# EAGLE design ColorDisplay (EAGLE 7.1.0)
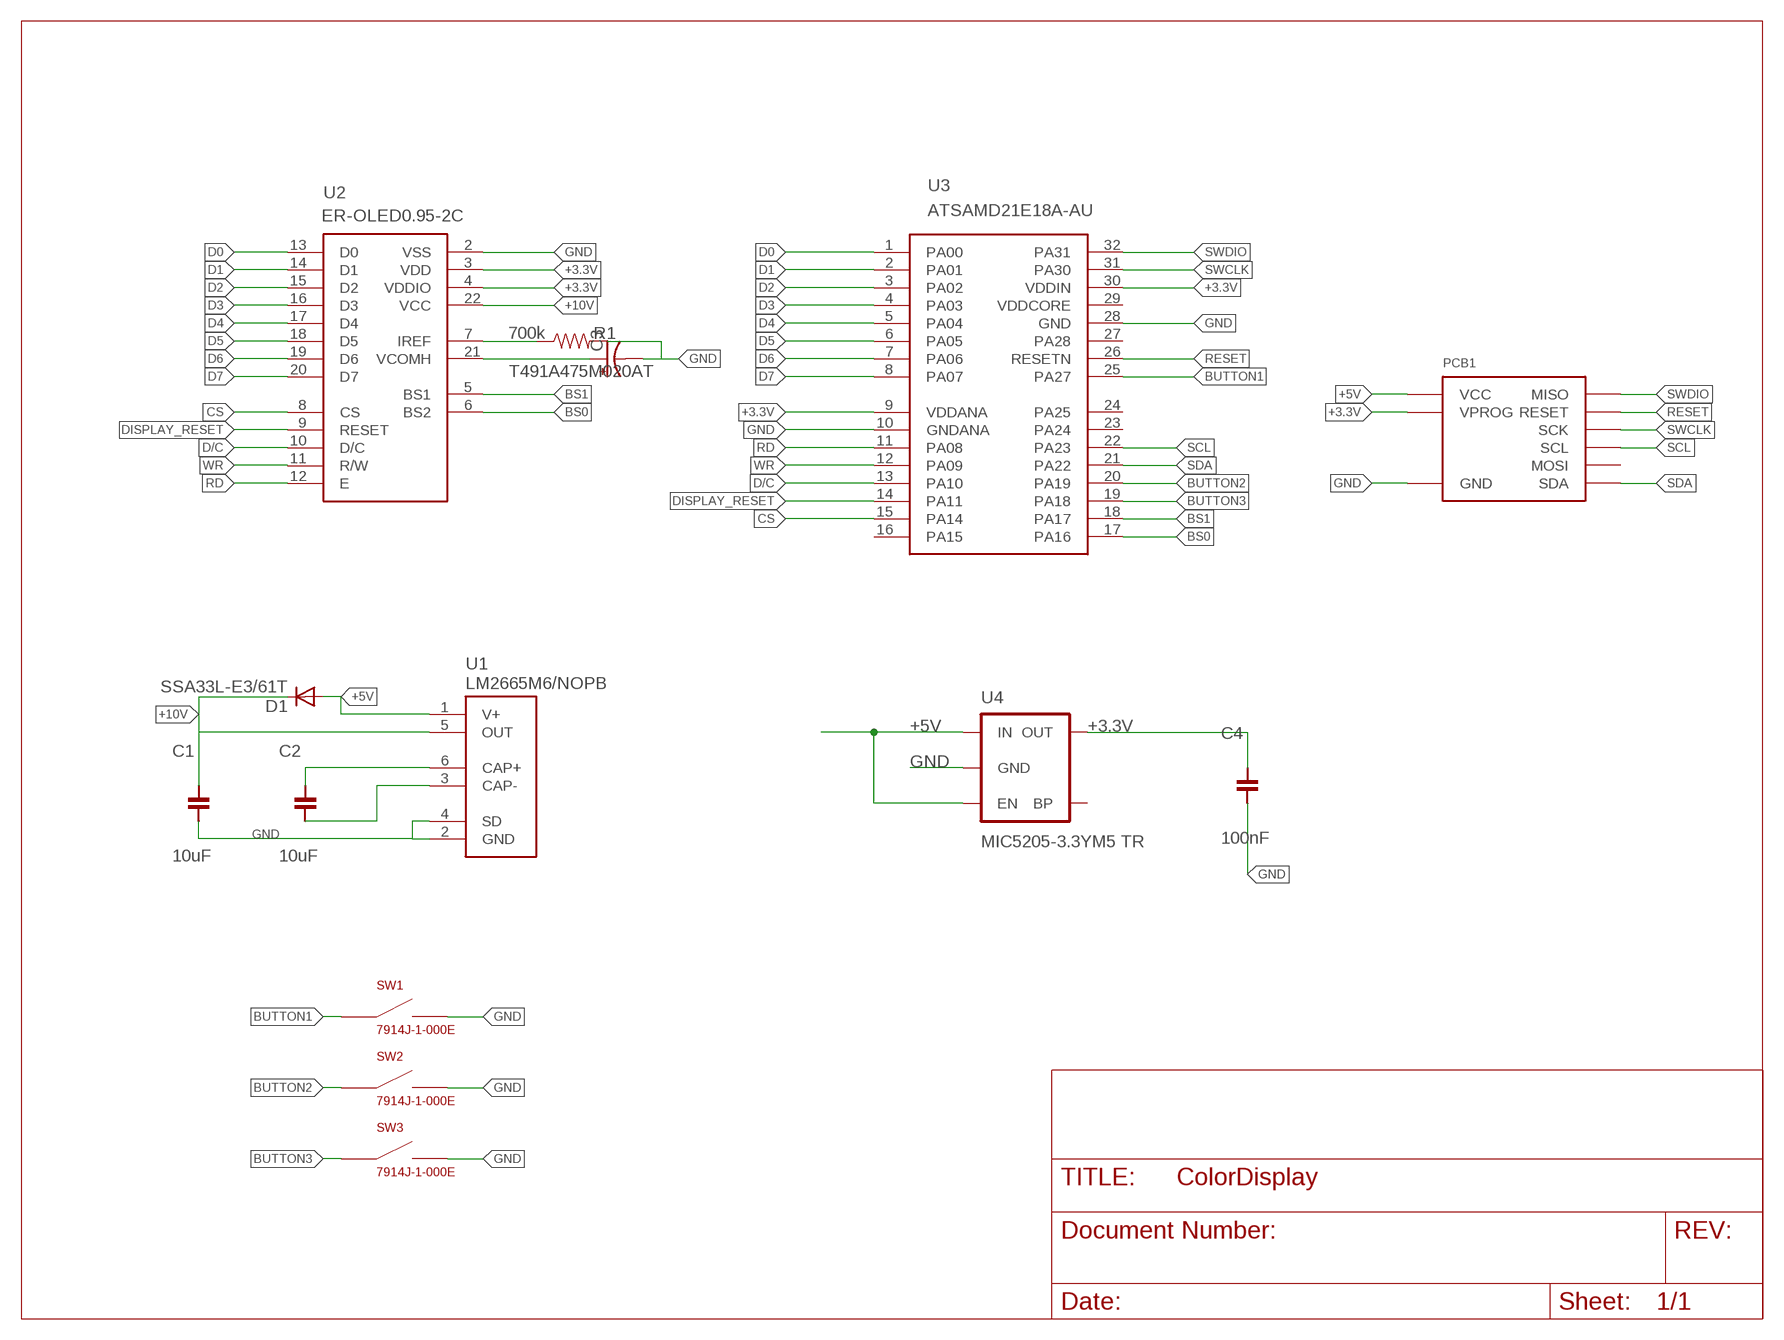
[diagram p0: schematic, sheet 1]

## Parts
C1  10uF  CAPACITOR-10UF-1206  [C1206]
C2  10uF  CAPACITOR-10UF-1206  [C1206]
C3  T491A475M020AT  10UF-16V-10%(TANT)  [EIA3216]
C4  100nF  CAPACITOR-100NF  [0603]
D1  SSA33L-E3/61T  DIODESMA  [SMA-DIODE]
PCB1  DEVICE-PCB-TABS  [DEVICE-PCB-TABS]
R1  700k  RESISTOR-0603  [0603]
SW1  7914J-1-000E  SWITCHBOURNS-7914J  [BOURNS-7914J]
SW2  7914J-1-000E  SWITCHBOURNS-7914J  [BOURNS-7914J]
SW3  7914J-1-000E  SWITCHBOURNS-7914J  [BOURNS-7914J]
U1  LM2665M6/NOPB  LM2665  [SOT-26]
U2  ER-OLED0.95-2C  OLED-COLORREVERSE  [FPC-24-REVERSE]
U3  ATSAMD21E18A-AU  SAMD21E  [TQFP-32]
U4  MIC5205-3.3YM5 TR  VREG-MIC5205-3.3V  [SOT23-5]

## Nets
+3.3V: C4.1 PCB1.PROG0(VPROG) U2.3(VDD) U2.4(VDDIO) U3.9(VDDANA) U3.30(VDDIN) U4.5(OUT)
+5V: D1.A PCB1.BUS2(VCC) U1.1(V+) U4.1(IN) U4.3(EN)
+10V: C1.1 D1.C U1.5(OUT) U2.22(VCC)
BS0: U2.6(BS2) U3.17(PA16)
BS1: U2.5(BS1) U3.18(PA17)
BUTTON1: SW1.POS$1(POS1) SW1.POS$2(POS1) U3.25(PA27)
BUTTON2: SW2.POS$1(POS1) SW2.POS$2(POS1) U3.20(PA19)
BUTTON3: SW3.POS$1(POS1) SW3.POS$2(POS1) U3.19(PA18)
CS: U2.8(CS) U3.15(PA14)
D0: U2.13(D0) U3.1(PA00)
D1: U2.14(D1) U3.2(PA01)
D2: U2.15(D2) U3.3(PA02)
D3: U2.16(D3) U3.4(PA03)
D4: U2.17(D4) U3.5(PA04)
D5: U2.18(D5) U3.6(PA05)
D6: U2.19(D6) U3.7(PA06)
D7: U2.20(D7) U3.8(PA07)
D/C: U2.10(D/C) U3.13(PA10)
DISPLAY_RESET: U2.9(RESET) U3.14(PA11)
GND: C1.2 C3.C(-) C4.2 PCB1.BUS0(GND) R1.2 SW1.NEG$1(NEG1) SW1.NEG$2(NEG1) SW2.NEG$1(NEG1) SW2.NEG$2(NEG1) SW3.NEG$1(NEG1) SW3.NEG$2(NEG1) U1.2(GND) U1.4(SD) U2.2(VSS) U3.10(GNDANA) U3.28(GND) U4.2(GND)
N$5: C3.A(+) U2.21(VCOMH)
N$8: R1.1 U2.7(IREF)
N$13: C2.1 U1.6(CAP+)
N$14: C2.2 U1.3(CAP-)
RD: U2.12(E) U3.11(PA08)
RESET: PCB1.PROG1(RESET) U3.26(RESETN)
SCL: PCB1.BUS3(SCL) U3.22(PA23)
SDA: PCB1.BUS1(SDA) U3.21(PA22)
SWCLK: PCB1.PROG2(SCK) U3.31(PA30)
SWDIO: PCB1.PROG3(MISO) U3.32(PA31)
WR: U2.11(R/W) U3.12(PA09)
Unconnected: PCB1.PROG4(MOSI) U3.16(PA15) U3.23(PA24) U3.24(PA25) U3.27(PA28) U3.29(VDDCORE) U4.4(BP)

## Library data of the parts
C1 C2 = Modulo:CAPACITOR: Capacitor; PARTNUM: CL31A106KAHNNNE
C3 = SparkFun-Capacitors:10UF-16V-10%(TANT): CAP-00811 1206/EIA-3216 Tantalum capacitor; PROD_ID: CAP-00811; VALUE: 10uF
C4 = Modulo:CAPACITOR: Capacitor; PARTNUM: C0603C104K5RACTU
D1 = SparkFun-DiscreteSemi:DIODE: Diode These are standard reverse protection diodes and small signal diodes. SMA package can handle up to about 1A. SOD-323 can handle about 200mA. What the SOD-323 package when ordering, there are some mfgs out there that are 5-pin packages.; PARTNUM: SSA33L-E3/61T
PCB1 = Modulo:DEVICE-PCB: Modulo Footprint; BOARD: Display; VERSION: 2
R1 = Modulo:RESISTOR: Resistor Basic schematic elements and footprints for 0603, 1206, and PTH resistors.
SW1-SW3 = Modulo:SWITCH
U1 = Modulo:LM2665
U2 = Modulo:OLED-COLOR; MANUFACTURER: buydisplay.com; SUPPLIER: buydisplay.com
U3 = Modulo:SAMD21E
U4 = Modulo:VREG-MIC5205: V_REG MIC5219 Standard 3.3V and 5V 150mA LDO voltage regulator in SOT-23 layout. Micrel part MIC5205. BP (by-pass) pin is used to lower output noise with 470pF cap, may be left open.

## Board
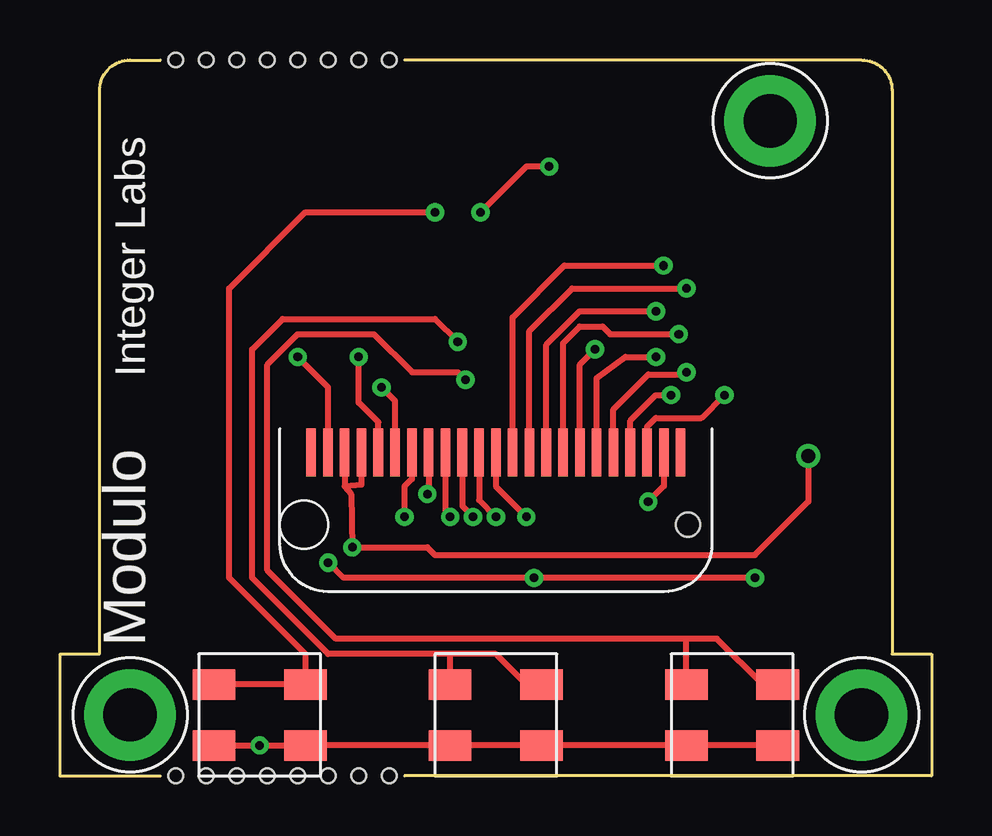
[diagram p1: board, top side]
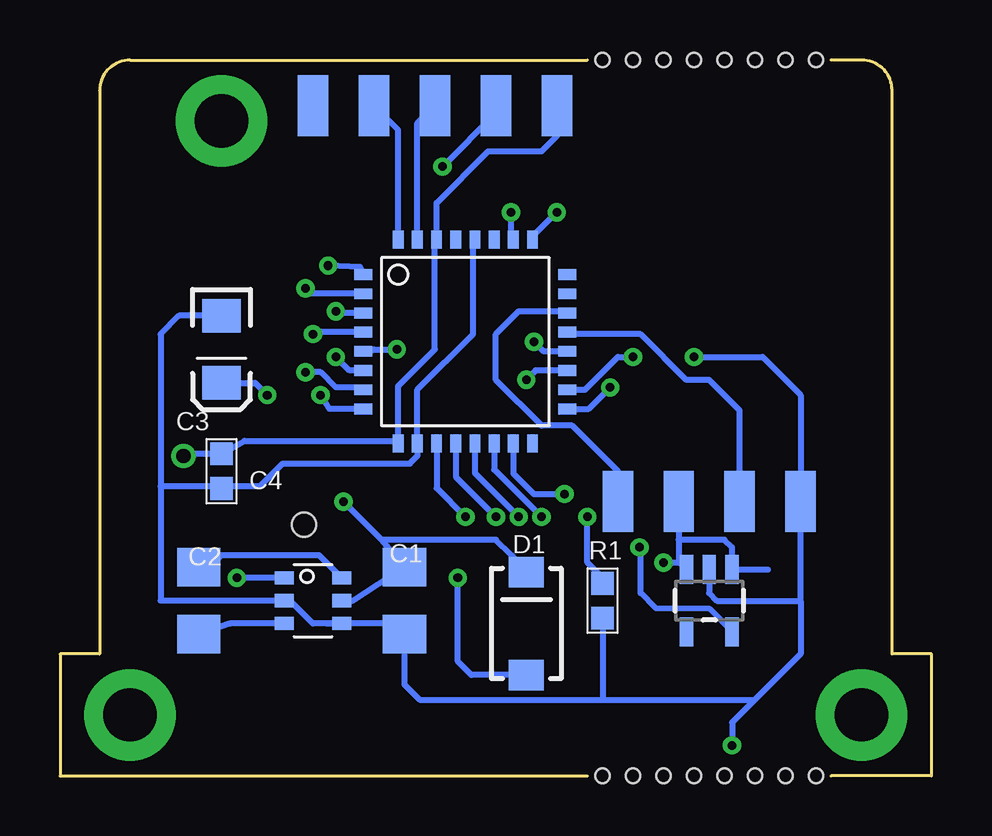
[diagram p2: board, bottom side, seen from below]

Size 36.32 x 29.84 mm. Coordinates in mm from the lower left corner, seen from the top.
Copper layers (1*16): Top 0.0178mm / dielectric 59mil / Bottom 0.0178mm
Design rules "SSC-EAGLE-2Lyr_v1.0.0.3": minimum track width 6mil, minimum drill 14mil, track to track 6mil, track to pad 6mil, pad to pad 6mil, via to via 6mil, smd to smd 6mil, copper to edge 20mil, drill to drill 16mil, minimum pad ring 8mil, minimum via ring 8mil, stop-mask expansion 3mil, vias tented up to drill 0mil, thermal gap 10mil

### Footprints (pad centres in the part's own frame; a part is rotated, then mirrored left to right if it is on the bottom)
C1206 = smd 1.6 x 1.8: 1 -1.4,0; 2 1.4,0
EIA3216 = smd 1.4 x 1.6: A 1.4,0; C -1.4,0
0603 = smd 0.95 x 0.95: 1 -0.725,0; 2 0.725,0
SMA-DIODE = smd 1.27 x 1.47: A -2.15,0; C 2.15,0
DEVICE-PCB-TABS = smd 1.27 x 2.54 bottom: BUS0 5.08,11.43; BUS1 7.62,11.43; BUS2 10.16,11.43; BUS3 12.7,11.43; PROG0 15.24,27.94; PROG1 17.78,27.94; PROG2 20.32,27.94; PROG3 22.86,27.94; PROG4 25.4,27.94 | drill 2.223 pad 3.81: P$1 2.54,2.54; P$2 33.02,2.54; P$3 29.21,27.305 | hole 0.6: 4.445,29.845; 5.715,29.845; 6.985,29.845; 8.255,29.845; 9.525,29.845; 10.795,29.845; 12.065,29.845; 13.335,29.845; 4.445,0; 5.715,0; 6.985,0; 8.255,0; 9.525,0; 10.795,0; 12.065,0; 13.335,0
BOURNS-7914J = smd 1.27 x 1.778: NEG$1 1.27,1.905; NEG$2 1.27,-1.905; POS$1 -1.27,1.905; POS$2 -1.27,-1.905
SOT-26 = smd 0.55 x 0.8: 1 -0.95,-1.2; 2 0,-1.2; 3 0.95,-1.2; 4 0.95,1.2; 5 0,1.2; 6 -0.95,1.2
FPC-24-REVERSE = smd 0.4 x 2: 1 7.7,1; 2 7,1; 3 6.3,1; 4 5.6,1; 5 4.9,1; 6 4.2,1; 7 3.5,1; 8 2.8,1; 9 2.1,1; 10 1.4,1; 11 0.7,1; 12 0,1; 13 -0.7,1; 14 -1.4,1; 15 -2.1,1; 16 -2.8,1; 17 -3.5,1; 18 -4.2,1; 19 -4.9,1; 20 -5.6,1; 21 -6.3,1; 22 -7,1; 23 -7.7,1 | hole 1: -8,4
TQFP-32 = smd 0.75 x 0.45: 1 -4.25,2.8; 2 -4.25,2; 3 -4.25,1.2; 4 -4.25,0.4; 5 -4.25,-0.4; 6 -4.25,-1.2; 7 -4.25,-2; 8 -4.25,-2.8; 17 4.25,-2.8; 18 4.25,-2; 19 4.25,-1.2; 20 4.25,-0.4; 21 4.25,0.4; 22 4.25,1.2; 23 4.25,2; 24 4.25,2.8 | smd 0.45 x 0.75: 9 -2.8,-4.25; 10 -2,-4.25; 11 -1.2,-4.25; 12 -0.4,-4.25; 13 0.4,-4.25; 14 1.2,-4.25; 15 2,-4.25; 16 2.8,-4.25; 25 2.8,4.25; 26 2,4.25; 27 1.2,4.25; 28 0.4,4.25; 29 -0.4,4.25; 30 -1.2,4.25; 31 -2,4.25; 32 -2.8,4.25
SOT23-5 = smd 0.55 x 1.2: 1 -0.95,-1.3; 2 0,-1.3; 3 0.95,-1.3; 4 0.95,1.3; 5 -0.95,1.3

### Placement (x,y rotation side)
C1  21.97,7.3 270 bottom
C2  30.54,7.3 270 bottom
C3  29.59,17.78 270 bottom
C4  29.59,12.7 270 bottom
D1  16.89,6.35 90 bottom
PCB1  0.38,0 0 top
R1  13.72,7.3 270 bottom
SW1  8.32,2.54 270 top
SW2  18.16,2.54 270 top
SW3  28,2.54 270 top
U1  25.78,7.3 270 bottom
U2  18.16,14.48 180 top
U3  19.43,18.1 0 bottom
U4  9.27,7.3 180 bottom

### Tracks (layer width: path | path; a pad name or v marks a point on that pad's centre or on a via)
+3.3V  (via drill 0.36, 0.6)
  Top 0.254: U2.3 11.86,12.06 | 11.86,12.06 12.13,11.75 v12.18,9.53 15.3,9.53 15.62,9.21 28.96,9.21 31.18,11.43 v31.18,13.34 | U2.4 12.56,12.13 11.86,12.06
  Bottom 0.254: PCB1.PROG0 15.62,26.67 16.26,26.04 18.48,26.04 20.63,23.88 U3.30 20.7,22.28 20.7,17.78 22.23,16.25 U3.9 22.35,13.97 28.64,13.97 C4.1 31.09,13.43 v31.18,13.34 | U4.5 9.24,6.96 11.49,6.99 12.13,7.62 12.13,9.16 v12.18,9.53
+5V  (via drill 0.36)
  Top 0.254: v11.18,8.89 11.81,8.26 v19.75,8.26 v28.96,8.26
  Bottom 0.254: 6.81,8.6 U4.1 8.32,9.53 8.64,9.84 10.54,9.84 | U1.1 28.32,8.25 v28.96,8.26 | PCB1.BUS2 10.54,9.84 | 10.54,9.84 10.54,8.92 U4.3 10.51,8.89 v11.18,8.89 | D1.A 19.19,4.2 19.75,4.76 v19.75,8.26
+10V  (via drill 0.36)
  Top 0.254: U2.22 25.16,12.08 v24.51,11.43
  Bottom 0.254: U1.5 24.14,7.3 C1.1 22.92,9.84 | 22.92,9.84 v24.51,11.43 | D1.C 17.53,9.21 18.16,9.84 22.92,9.84
BS0  (via drill 0.36)
  Top 0.254: U2.6 13.96,15.63 v13.4,16.19
  Bottom 0.254: U3.17 14.29,15.3 v13.4,16.19
BS1  (via drill 0.36)
  Top 0.254: U2.5 13.26,14.74 12.45,15.56 v12.45,17.46
  Bottom 0.254: U3.18 14.45,16.1 13.08,17.46 v12.45,17.46
BUTTON1  (via drill 0.36)
  Top 0.254: v15.62,23.5 10.22,23.5 7.05,20.32 7.05,8.26 10.22,5.08 SW1.POS$1 | 9.91,3.81 SW1.POS$1 | SW1.POS$1 SW1.POS$2
  Bottom 0.254: U3.25 16.57,22.54 v15.62,23.5
BUTTON2  (via drill 0.36)
  Top 0.254: SW2.POS$1 19.43,3.81 18.16,5.08 16.26,5.08 | 16.26,5.08 11.18,5.08 8,8.26 8,17.78 9.27,19.05 15.62,19.05 v16.57,18.1 | SW2.POS$2 16.26,5.08
  Bottom 0.254: U3.20 16.17,17.7 v16.57,18.1
BUTTON3  (via drill 0.36)
  Top 0.254: SW3.POS$1 29.27,3.81 27.37,5.71 26.1,5.71 | 26.1,5.71 11.49,5.71 8.64,8.57 8.64,17.14 9.91,18.41 13.08,18.41 14.67,16.83 16.57,16.83 v16.89,16.51 | SW3.POS$2 26.1,5.71
  Bottom 0.254: U3.19 16.5,16.9 v16.89,16.51
CS  (via drill 0.36)
  Top 0.254: U2.8 15.36,11.8 v15.3,11.75
  Bottom 0.254: U3.15 17.43,12.61 16.57,11.75 v15.3,11.75
D0  (via drill 0.36)
  Top 0.254: U2.13 18.86,19.11 21.02,21.27 v25.15,21.27
  Bottom 0.254: U3.1 23.82,21.21 v25.15,21.27
D1  (via drill 0.36)
  Top 0.254: U2.14 19.56,18.55 21.34,20.32 v26.1,20.32
  Bottom 0.254: U3.2 26,20.1 v26.1,20.32
D2  (via drill 0.36)
  Top 0.254: U2.15 20.26,17.98 21.65,19.37 v24.83,19.37
  Bottom 0.254: U3.3 24.76,19.3 v24.83,19.37
D3  (via drill 0.36)
  Top 0.254: U2.16 20.96,18.04 21.65,18.73 22.61,18.73 22.92,18.41 v25.78,18.41
  Bottom 0.254: U3.4 25.7,18.5 v25.78,18.41
D4  (via drill 0.36)
  Top 0.254: U2.17 21.66,17.15 v22.29,17.78
  Bottom 0.254: U3.5 23.48,17.7 23.24,17.78 v22.29,17.78
D5  (via drill 0.36)
  Top 0.254: U2.18 22.36,16.58 23.56,17.46 v24.83,17.46
  Bottom 0.254: U3.6 24.26,16.9 v24.83,17.46
D6  (via drill 0.36)
  Top 0.254: U2.19 23.06,15.28 24.51,16.73 26.32,16.73 v26.1,16.83
  Bottom 0.254: U3.7 23.88,16.19 24.83,16.19 25.46,16.83 v26.1,16.83
D7  (via drill 0.36)
  Top 0.254: U2.20 23.76,14.81 24.83,15.88 v25.46,15.88
  Bottom 0.254: U3.8 25.09,15.3 v25.46,15.88
D/C  (via drill 0.36)
  Top 0.254: U2.10 16.76,11.24 v17.21,10.79
  Bottom 0.254: U3.13 19.03,12.62 v17.21,10.79
DISPLAY_RESET  (via drill 0.36)
  Top 0.254: U2.9 16.06,10.99 v16.26,10.79
  Bottom 0.254: U3.14 18.23,12.77 v16.26,10.79
GND  (via drill 0.36)
  Top 0.254: U2.2 11.18,13.34 11.18,16.19 v9.91,17.46 | SW3.NEG$1 SW3.NEG$2 SW2.NEG$1 SW2.NEG$2 SW1.NEG$1 v8.32,1.27 SW1.NEG$2
  Bottom 0.254: v9.91,17.46 7.05,17.46 5.46,15.88 PCB1.BUS0 5.46,7.3 | C3.C 31.37,19.18 32.13,18.41 32.13,12.06 | 32.13,12.06 32.13,7.3 U1.2 26.73,7.3 25.78,6.35 U1.4 25.21,6.35 22.29,6.35 22.24,6.4 C1.2 21.97,3.81 21.34,3.17 13.72,3.17 | U4.2 9.27,7.62 8.95,7.3 5.46,7.3 | 5.46,7.3 5.46,5.08 7.37,3.17 | U3.28 19.11,22.27 19.11,18.41 21.43,16.1 U3.10 21.43,13.34 21.75,13.02 27.05,13.02 28,12.06 29.5,12.06 | 13.72,3.17 7.37,3.17 | R1.2 13.72,3.17 | 7.37,3.17 8.32,2.22 v8.32,1.27 | 29.5,12.06 C4.2 | 29.5,12.06 32.13,12.06
N$5  (via drill 0.36)
  Top 0.254: 24.51,13.34 U2.21 24.46,14.55 24.83,14.92 26.73,14.92 v27.69,15.88
  Bottom 0.254: C3.A 28.19,16.38 v27.69,15.88
N$8  (via drill 0.36)
  Top 0.254: U2.7 14.66,12.38 14.35,12.06 v14.35,10.79
  Bottom 0.254: R1.1 13.72,8.26 14.35,8.89 v14.35,10.79
N$13
  Bottom 0.254: C2.1 30.54,8.26 29.59,9.21 25.54,9.21 U1.6
N$14
  Bottom 0.254: U1.3 29.22,6.35 C2.2
RD  (via drill 0.36)
  Top 0.254: U2.12 18.16,12.06 v19.43,10.79
  Bottom 0.254: U3.11 20.63,11.99 v19.43,10.79
RESET  (via drill 0.36)
  Top 0.254: v20.38,25.4 19.43,25.4 v17.53,23.5
  Bottom 0.254: U3.26 17.53,22.54 v17.53,23.5 | PCB1.PROG1 18.16,27.62 v20.38,25.4
SCL
  Bottom 0.254: PCB1.BUS3 13.08,12.7 14.99,14.61 16.26,14.61 18.16,16.51 18.16,18.41 17.21,19.37 15.25,19.37 U3.22
SDA
  Bottom 0.254: PCB1.BUS1 8,15.24 9.27,16.51 10.22,16.51 12.13,18.41 15.1,18.41 U3.21
SWCLK
  Bottom 0.254: U3.31 21.43,27.21 PCB1.PROG2
SWDIO
  Bottom 0.254: U3.32 22.23,26.93 PCB1.PROG3
WR  (via drill 0.36)
  Top 0.254: U2.11 17.46,11.49 v18.16,10.79
  Bottom 0.254: U3.12 19.83,12.46 v18.16,10.79